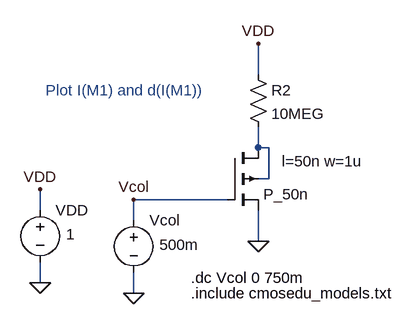
[diagram p0: schematic Fig17_29.asc]
Fig17_29.asc, the LTspice schematic file:
Version 4
SHEET 1 1556 680
WIRE 656 -288 656 -336
WIRE 656 -176 656 -208
WIRE 672 -176 656 -176
WIRE 672 -128 672 -176
WIRE 672 -128 656 -128
WIRE 608 -96 464 -96
WIRE 320 -80 320 -112
WIRE 464 -64 464 -96
WIRE 656 -32 656 -80
WIRE 320 32 320 0
WIRE 464 48 464 16
FLAG 320 32 0
FLAG 320 -112 VDD
FLAG 464 48 0
FLAG 464 -96 Vcol
FLAG 656 -336 VDD
FLAG 656 -32 0
SYMBOL voltage 320 -96 R0
WINDOW 123 0 0 Left 0
WINDOW 39 0 0 Left 0
WINDOW 3 40 53 Left 0
SYMATTR Value 1
SYMATTR InstName VDD
SYMBOL pmos4 608 -176 R0
WINDOW 0 56 32 Invisible 0
WINDOW 123 84 21 Left 0
SYMATTR InstName M1
SYMATTR Value2 l=50n w=1u
SYMATTR Value P_50n
SYMBOL voltage 464 -80 R0
WINDOW 123 0 0 Left 0
WINDOW 39 0 0 Left 0
WINDOW 3 40 53 Left 0
SYMATTR Value 500m
SYMATTR InstName Vcol
SYMBOL res 640 -304 R0
SYMATTR InstName R2
SYMATTR Value 10MEG
TEXT 552 48 Left 0 !.include cmosedu_models.txt
TEXT 552 24 Left 0 !.dc Vcol 0 750m 
TEXT 328 -264 Left 0 ;Plot I(M1) and d(I(M1))

The netlist it stands for:
* Fig17_29.asc
VDD VDD 0 1
M1 N001 Vcol 0 N001 P_50n l=50n w=1u
Vcol Vcol 0 500m
R2 VDD N001 10MEG
.model NMOS NMOS
.model PMOS PMOS
.lib standard.mos
.include cmosedu_models.txt
.dc Vcol 0 750m
* Plot I(M1) and d(I(M1))
.backanno
.end